# Altium schematic sheet DoorCardController.SchDoc
size A4
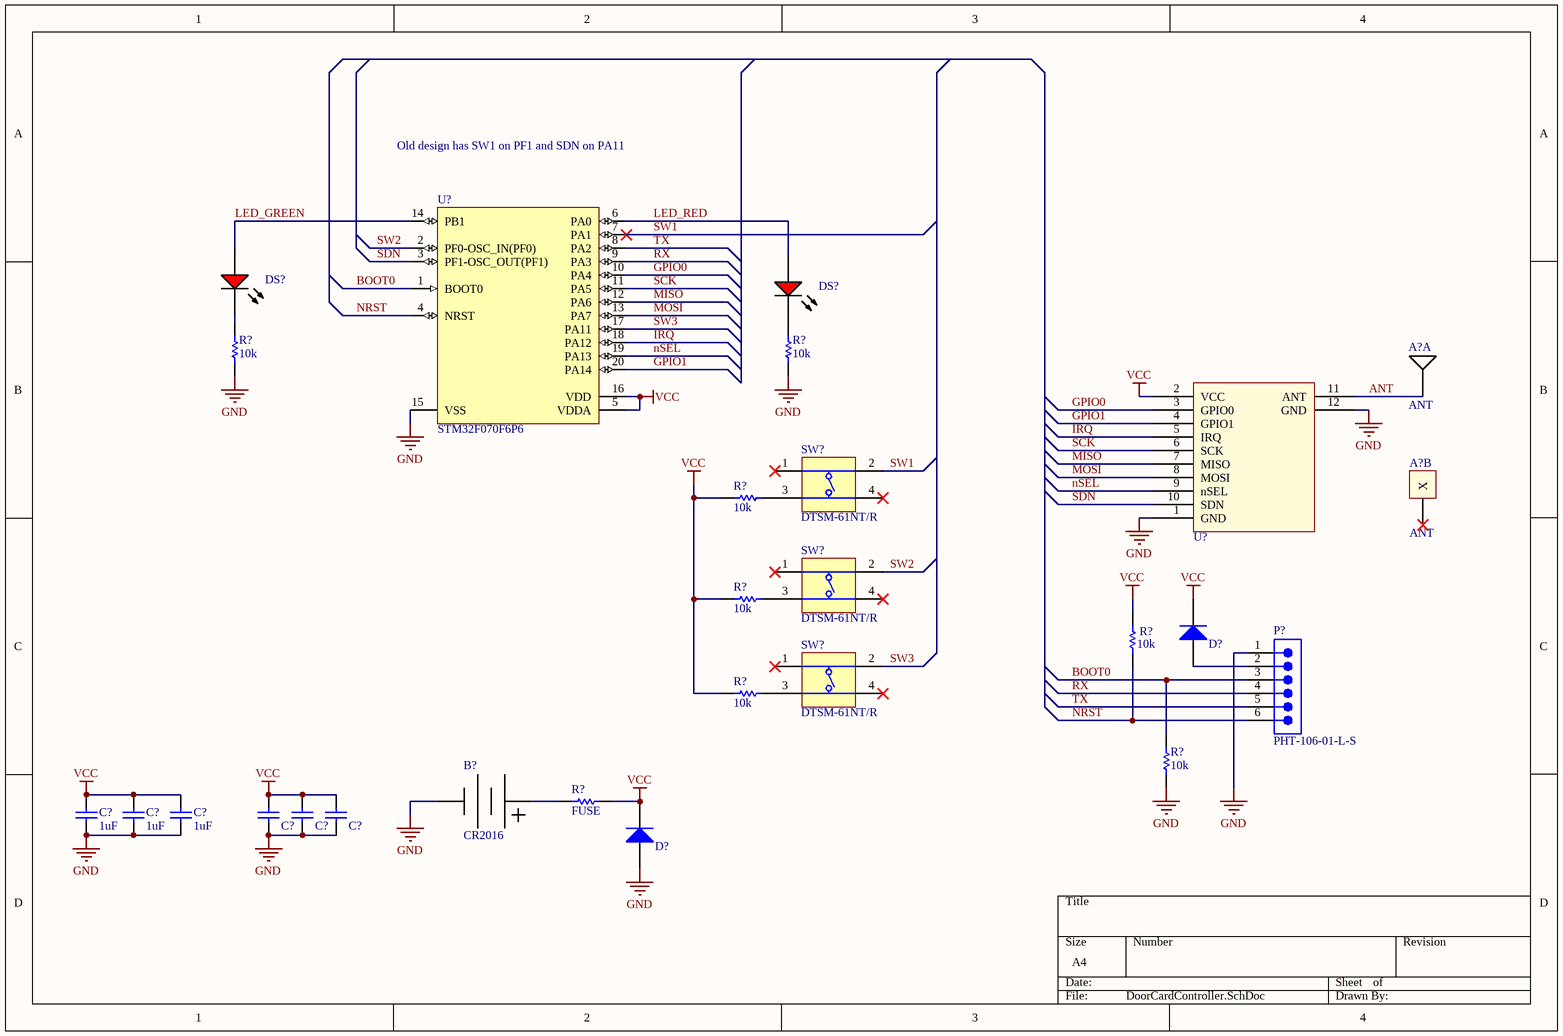
[diagram p0: DoorCardController.SchDoc]

## Parts
(Parts that share a designator on the sheet are numbered #1, #2 ... from top to bottom, then left to right.)
A?#1  ANT  [433MHz_Antenna]  (part A of 2)
A?#2  ANT  [433MHz_Antenna]  (part B of 2)
B?  CR2016  [CR2012]
C?#1  1uF  [CAPC0805(2012)100_M]
C?#2  1uF  [CAPC0805(2012)100_M]
C?#3  1uF  [CAPC0805(2012)100_M]
C?#4  CAP 47uF 6.3V 1206(3216)  [CAPC1206(3216)190_M]  (value not drawn)
C?#5  CAP 47uF 6.3V 1206(3216)  [CAPC1206(3216)190_M]  (value not drawn)
C?#6  CAP 47uF 6.3V 1206(3216)  [CAPC1206(3216)190_M]  (value not drawn)
D?#1  MMSD4148T3G  [ONSC-SOD123-2-425G-04_V]  (value not drawn)
D?#2  MMSD4148T3G  [ONSC-SOD123-2-425G-04_V]  (value not drawn)
DS?#1  TLMS1100-GS08  [VISH-TLMX1100_V]  (value not drawn)
DS?#2  TLMS1100-GS08  [VISH-TLMX1100_V]  (value not drawn)
P?  PHT-106-01-L-S  [SMTC-PHT-106-01-X-S]
R?#1  10k  [RESC0805(2012)_L]
R?#2  10k  [RESC0805(2012)_L]
R?#3  10k  [RESC0805(2012)_L]
R?#4  10k  [RESC0805(2012)_L]
R?#5  10k  [RESC0805(2012)_L]
R?#6  10k  [RESC0805(2012)_L]
R?#7  10k  [RESC0805(2012)_L]
R?#8  FUSE  [RESC0805(2012)_L]
SW?#1  DTSM-61NT/R  [DIPT-DTSM-6_V]
SW?#2  DTSM-61NT/R  [DIPT-DTSM-6_V]
SW?#3  DTSM-61NT/R  [DIPT-DTSM-6_V]
U?#1  STM32F070F6P6  [STM-TSSOP20_M]
U?#2  Si4463  [E10-433MS]  (value not drawn)

## Nets
GND: B?.2 C?#1.1 C?#2.1 C?#3.1 C?#4.1 C?#5.1 C?#6.1 D?#2.2(ANODE) P?.1 R?#1.1 R?#2.1 R?#7.1 U?#1.15(VSS) U?#2.1(GND) U?#2.12(GND)
VCC: C?#1.2 C?#2.2 C?#3.2 C?#4.2 C?#5.2 C?#6.2 D?#1.1(CATHODE) D?#2.1(CATHODE) R?#3.2 R?#4.1 R?#5.2 R?#6.2 R?#8.1 U?#1.5(VDDA) U?#1.16(VDD) U?#2.2(VCC)
ANT: A?#1.1(ANT) U?#2.11(ANT)
BOOT0: P?.3 R?#7.2 U?#1.1(BOOT0)
GPIO0: U?#1.10(PA4) U?#2.3(GPIO0)
GPIO1: U?#1.20(PA14) U?#2.4(GPIO1)
IRQ: U?#1.18(PA12) U?#2.5(IRQ)
LED_GREEN: DS?#1.1(A) U?#1.14(PB1)
LED_RED: DS?#2.1(A) U?#1.6(PA0)
MISO: U?#1.12(PA6) U?#2.7(MISO)
MOSI: U?#1.13(PA7) U?#2.8(MOSI)
NRST: P?.6 R?#5.1 U?#1.4(NRST)
nSEL: U?#1.19(PA13) U?#2.9(nSEL)
RX: P?.4 U?#1.9(PA3)
SCK: U?#1.11(PA5) U?#2.6(SCK)
SDN: U?#1.3(PF1-OSC_OUT(PF1)) U?#2.10(SDN)
SW1: SW?#1.2(T2) U?#1.7(PA1)
SW2: SW?#2.2(T2) U?#1.2(PF0-OSC_IN(PF0))
SW3: SW?#3.2(T2) U?#1.17(PA11)
TX: P?.5 U?#1.8(PA2)
NetB?_1: B?.1 R?#8.2
NetD?#1_2: D?#1.2(ANODE) P?.2
NetDS?#1_2: DS?#1.2(K) R?#1.2
NetDS?#2_2: DS?#2.2(K) R?#2.2
NetR?#3_1: R?#3.1 SW?#1.3(T3)
NetR?#4_2: R?#4.2 SW?#2.3(T3)
NetR?#6_1: R?#6.1 SW?#3.3(T3)

Not connected (* = marked no-connect by the designer): A?#2 2(X)*; SW?#1 1(T1)* 4(T3)*; SW?#2 1(T1)* 4(T3)*; SW?#3 1(T1)* 4(T3)*

## Notes on the sheet
- Old design has SW1 on PF1 and SDN on PA11

## Library data of the parts
A?#1 A?#2 = ANT1204F002R0433A
B? = BAT-HLD-002-SMT
C?#1-C?#3 = CMP-1036-04754-1: CAP 1uF 25V ±10% 0805 (2012 Metric) Thickness 1mm SMD; Case-EIA: 0805; Case-Metric: 2012; Tolerance: Â±10%; Max Thickness: 1 mm; Value: 1uF; Rated Voltage: 25 V; Technology: SMT
C?#4-C?#6 = CMP-1037-05000-1: CAP 47uF 6.3V ±20% 1206 (3216 Metric) Thickness 1.9mm SMD; Case-EIA: 1206; Case-Metric: 3216; Tolerance: Â±20%; Max Thickness: 1.9 mm; Value: 47uF; Technology: SMT; Rated Voltage: 6.3 V
D?#1 D?#2 = CMP-0895-00002-1: Switching Diode, 100 V, 200 mA, -55 to 150 degC, 2-Pin SOD123 (425), RoHS, Tape and Reel; Manufacturer: ON Semiconductor; CD (Max): 4 pF; IR @ VR: 75 V (Max)=50 uA; PD (Max): 425 mW; VF (Max): 1 A; Trr (Max): 4 ns; VBR (Min): 100 V; ComponentLink1URL: http://www.onsemi.com/; ComponentLink1Description: Manufacturer URL; PackageReference: SOD123-2-425G-04; PackageDescription: 2-Pin SOD123, Body 2.69 x 1.6 mm, Height 1.35 mm; ComponentLink2Description: Datasheet; Mounting Technology: Surface Mount; RoHS: TRUE; PartNumber: MMSD4148T3G; PackageVersion: Rev. 04G; DatasheetVersion: Rev. 11; Temperature Range: -55 to 150 degC; ComponentLink3Description: Package Specification; Packing: Tape and Reel; ComponentLink3URL: http://www.onsemi.com/pub_link/Collateral/425-04.PDF; ComponentLink2URL: http://www.onsemi.com/pub_link/Collateral/MMSD4148T1-D.PDF
DS?#1 DS?#2 = CMP-1666-00027-1: LED, RED, 2.1 V, -40 to 100 degC, 2-Pin SMD (0603), RoHS, Tape and Reel; Type (Capacitors): C0G; Resistance: 100000000000 Ohm; Capacitance: 12 pF; Voltage Rating: 50 V; Tolerance: 5%; Min Operating Temperature: -55degC; REACH SVHC: No SVHC; ComponentLink2Description: Datasheet; ComponentLink1URL: http://www.vishay.com/; Width: 0.8 mm; Package Quantity: 4000; PackageReference: TLMX1100; ComponentLink2URL: http://www.vishay.com/docs/83173/tlmb1100.pdf; Case/Package: 0603; Case Code (Metric): 1608; Packaging: Tape and Reel; Pins: 2; ComponentLink1Description: Manufacturer URL; Max Operating Temperature: 125degC; Height: 0.8 mm; Length: 1.6 mm; Mount: Surface Mount; PackageDescription: 2-Pin Surface Mount Device, Body 1.6 x 0.8 mm; DatasheetVersion: Rev. 2.7, 03/2016; Case Code (Imperial): 0603; Voltage Rating (DC): 50 V; RoHSCompliant: True; Radiation Hardening: No
P? = CMP-1024-00187-1: Press Fit Header, Through-hole, Vertical, -55 to 125 degC, 2.54 mm Pitch, 6-Pin, Male, RoHS; Manufacturer: Samtec; Pitch: 2.54 mm; PackageReference: PHT-106-01-X-S; PackageDescription: .100 Press Fit Socket Assembly; ComponentLink3URL: http://www.samtec.com/documents/webfiles/cpdf/PHT-1XX-XX-X-X-XXX-MKT.pdf; PackageVersion: J, 9/2009; ComponentLink3Description: Package Specification; PartNumber: PHT-106-01-L-S; ComponentLink1Description: Manufacturer URL; Orientation: Vertical; Mounting Technology: Through-hole; ComponentLink1URL: http://www.samtec.com; ComponentLink2URL: http://www.samtec.com/documents/webfiles/pdf/pht.pdf; Temperature Range: -55 to 125 degC; RoHS: True; DatasheetVersion: F-214; ComponentLink2Description: Datasheet
R?#1-R?#7 = CMP-1013-00624-1: 10K2 0.125W 1% 0805 (2012 Metric)  SMD; Case-Metric: 2012; Case-EIA: 0805; Value: 10200.00 Ohm; Technology: SMT; Tolerance: 1 %; Power: 0.125 W
R?#8 = CMP-1013-00624-1: PTC Fuse; Case-Metric: 2012; Case-EIA: 0805; Value: 10200.00 Ohm; Tolerance: 1 %; Power: 0.125 W; Technology: SMT
SW?#1-SW?#3 = CMP-0306-00001-1: Switch, SPNO Push Button SMD; Manufacturer: Diptronics; Packing Type: Tape&Reel; Mechanical Life: 200,000 cycles; ComponentLink2URL: http://www.dip.com.tw/Products_tact.htm; ComponentLink1URL: http://www.dip.com.tw/; ComponentLink3URL: http://www.dip.com.tw/PDF/pro_tact/DTSM_G_-6_2_-V.pdf; PackageDescription: Switch, Through-Hole, 4 Leads, Body 8.5x8.5mm, Row Spacing 9.0mm, Pitch 4.5mm; ComponentLink2Description: Datasheet; ComponentLink3Description: Package Specification; ComponentLink1Description: Manufacturer URL; PackageReference: DTSM-6; PartNumber: DTSM-61NT/R; Mounting Technology: Through Hole
U?#1 = CMP-0304-00145-2: ARM Cortex-M0 32-bit MCU, 32 KB Flash, 6 KB Internal RAM, 15 I/Os, 20-Pin TSSOP, -40 to 85 degC, Tray; Manufacturer: STMicroelectronics; FLASH Size (Prog) (kB): 32; Internal RAM Size (kB): 6; Operating Frequency(F) (Processor speed) (MHz): 48; Supply Voltage(Vcc) min (V): 2.4; I/Os (High Current): 15; ComponentLink2URL: http://www.st.com/st-web-ui/static/active/en/resource/technical/document/datasheet/DM00141386.pdf; ComponentLink2Description: Datasheet; Packing: Tray; DatasheetVersion: Rev. 3; PartNumber: STM32F070F6P6; Core: ARM Cortex-M0; Package Reference: TSSOP20; Package Description: 20-Pin Thin Shrink Small Outline Package, Body 6.5 x 4.4 mm, Pitch 0.65 mm; ComponentLink1Description: Manufacturer URL; ComponentLink1URL: http://www.st.com/; Mounting Technology: Surface Mount
U?#2 = Component_1: E10-433MS